# Altium schematic sheet Power.SchDoc
size A4; SheetNumber: 1; SheetTotal: 1
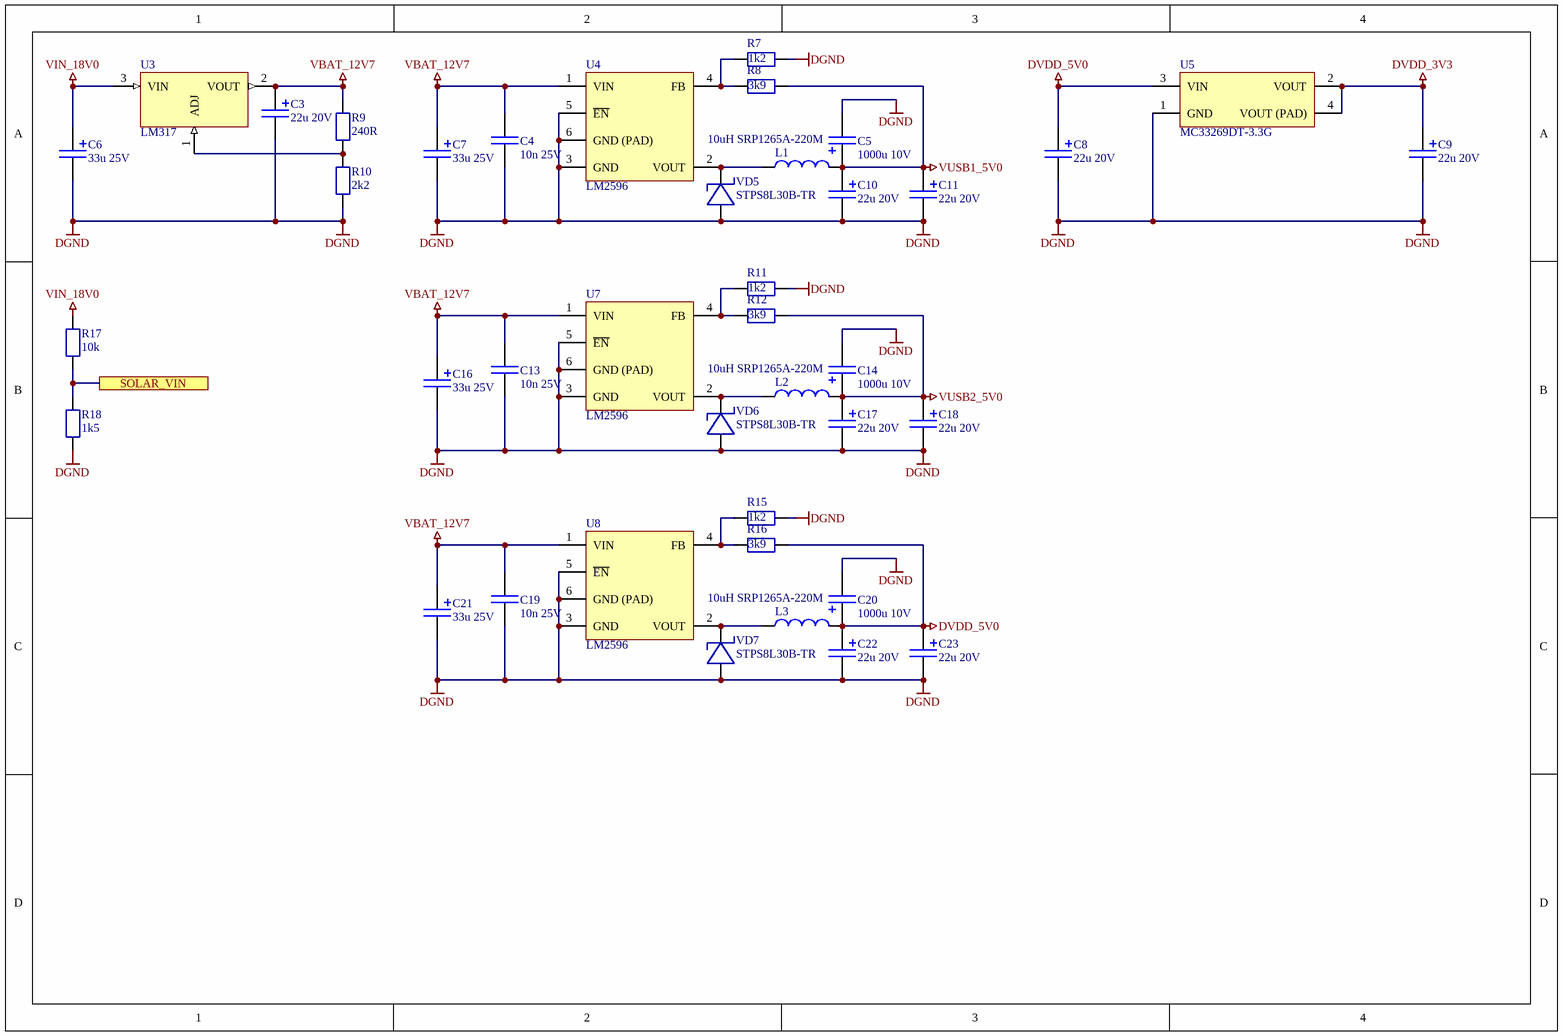
[diagram p0: Power.SchDoc]

## Parts
C3  22u 20V  [TECAP_TYPE_B]
C4  10n 25V  [C_0805/2012]
C5  1000u 10V  [ECAP_D10.0x10.5]
C6  33u 25V  [TECAP_TYPE_B]
C7  33u 25V  [TECAP_TYPE_C]
C8  22u 20V  [TECAP_TYPE_B]
C9  22u 20V  [TECAP_TYPE_B]
C10  22u 20V  [TECAP_TYPE_D]
C11  22u 20V  [TECAP_TYPE_D]
C13  10n 25V  [C_0805/2012]
C14  1000u 10V  [ECAP_D10.0x10.5]
C16  33u 25V  [TECAP_TYPE_C]
C17  22u 20V  [TECAP_TYPE_D]
C18  22u 20V  [TECAP_TYPE_D]
C19  10n 25V  [C_0805/2012]
C20  1000u 10V  [ECAP_D10.0x10.5]
C21  33u 25V  [TECAP_TYPE_C]
C22  22u 20V  [TECAP_TYPE_D]
C23  22u 20V  [TECAP_TYPE_D]
L1  10uH SRP1265A-220M  [L_13x13]
L2  10uH SRP1265A-220M  [L_13x13]
L3  10uH SRP1265A-220M  [L_13x13]
R7  1k2  [R_0805/2012]
R8  3k9  [R_0805/2012]
R9  240R  [R_0603/1608]
R10  2k2  [R_0603/1608]
R11  1k2  [R_0805/2012]
R12  3k9  [R_0805/2012]
R15  1k2  [R_0805/2012]
R16  3k9  [R_0805/2012]
R17  10k  [R_0603/1608]
R18  1k5  [R_0603/1608]
U3  LM317  [TO-220 HOR]
U4  LM2596  [TO263-5/D2PAK-5]
U5  MC33269DT-3.3G  [TO252AA/DPAK]
U7  LM2596  [TO263-5/D2PAK-5]
U8  LM2596  [TO263-5/D2PAK-5]
VD5  STPS8L30B-TR  [TO252AA/DPAK]
VD6  STPS8L30B-TR  [TO252AA/DPAK]
VD7  STPS8L30B-TR  [TO252AA/DPAK]

## Ports
SOLAR_VIN

## Nets
DGND: C3.2(NEG) C4.2 C5.2(NEG) C6.2(NEG) C7.2(NEG) C8.2(NEG) C9.2(NEG) C10.2(NEG) C11.2(NEG) C13.2 C14.2(NEG) C16.2(NEG) C17.2(NEG) C18.2(NEG) C19.2 C20.2(NEG) C21.2(NEG) C22.2(NEG) C23.2(NEG) R7.1 R10.1 R11.1 R15.1 R18.1 U4.3(GND) U4.5(~{EN}) U4.6(GND_(PAD)) U5.1(GND) U7.3(GND) U7.5(~{EN}) U7.6(GND_(PAD)) U8.3(GND) U8.5(~{EN}) U8.6(GND_(PAD)) VD5.1 VD6.1 VD7.1
DVDD_3V3: C9.1(POS) U5.2(VOUT) U5.4(VOUT_(PAD))
DVDD_5V0: C8.1(POS) C20.1(POS) C22.1(POS) C23.1(POS) L3.2 R16.1 U5.3(VIN)
VBAT_12V7: C3.1(POS) C4.1 C7.1(POS) C13.1 C16.1(POS) C19.1 C21.1(POS) R9.2 U3.2(VOUT) U4.1(VIN) U7.1(VIN) U8.1(VIN)
VIN_18V0: C6.1(POS) R17.2 U3.3(VIN)
VUSB1_5V0: C5.1(POS) C10.1(POS) C11.1(POS) L1.2 R8.1
VUSB2_5V0: C14.1(POS) C17.1(POS) C18.1(POS) L2.2 R12.1
SOLAR_VIN: R17.1 R18.2 ; port SOLAR_VIN
NetL1_1: L1.1 U4.2(VOUT) VD5.2
NetL2_1: L2.1 U7.2(VOUT) VD6.2
NetL3_1: L3.1 U8.2(VOUT) VD7.2
NetR7_2: R7.2 R8.2 U4.4(FB)
NetR9_1: R9.1 R10.2 U3.1(ADJ)
NetR11_2: R11.2 R12.2 U7.4(FB)
NetR15_2: R15.2 R16.2 U8.4(FB)

## Library data of the parts
C3 C8-C11 C17 C18 C22 C23 = Capacitor polar: Polarized capacitor / (9000629220)
C4 C13 C19 = Capacitor: Non-polarized capacitor
C5 C14 C20 = Capacitor polar: Polarized capacitor
C6 C7 C16 C21 = Capacitor polar: Polarized capacitor / (9000629234)
L1-L3 = Inductor
R7-R12 R15-R18 = Resistor
U3 = LM317: Linear regulator LM317
U4 U7 U8 = LM2576: DC-DC step-down switching regulator
U5 = LM1117: LDO voltage regulator; pin to pad: 2>3 3>2 4>3
VD5-VD7 = Schottky: Schottky diode; pin to pad: 2>3